# Altium schematic sheet FBridge.SchDoc
size A4; SheetNumber: 4; SheetTotal: 6
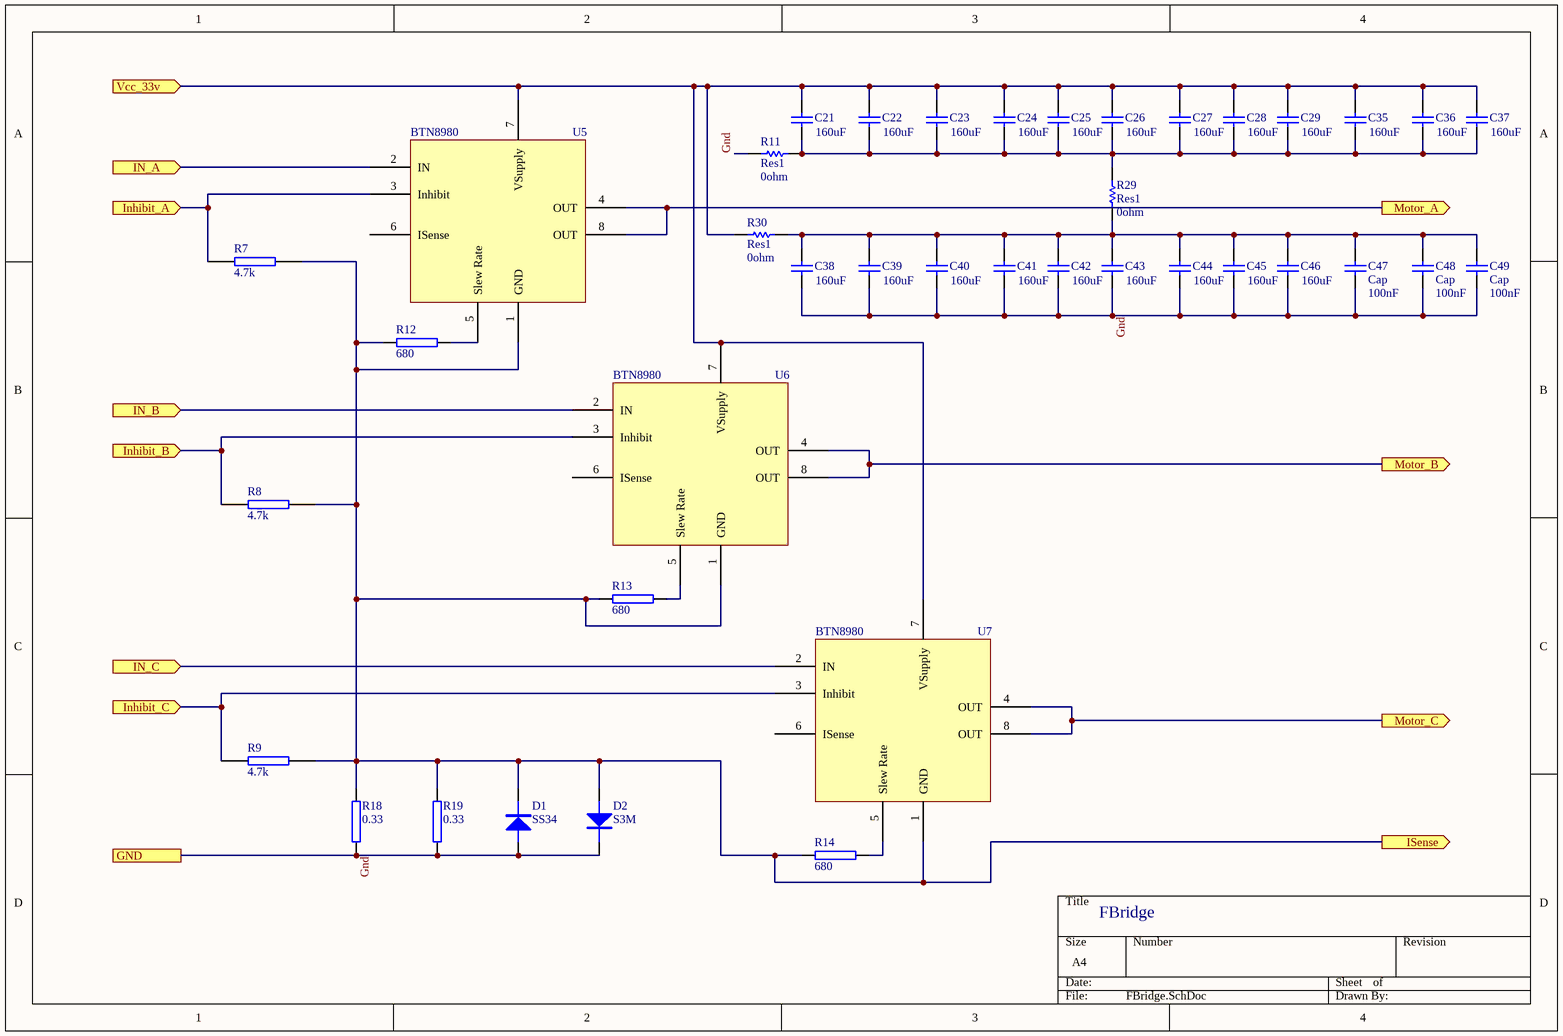
[diagram p0: FBridge.SchDoc]

## Parts
C21  value 160uF  [Tantalum_9545]  (hidden comment: Cap)
C22  value 160uF  [Tantalum_9545]  (hidden comment: Cap)
C23  value 160uF  [Tantalum_9545]  (hidden comment: Cap)
C24  value 160uF  [Tantalum_9545]  (hidden comment: Cap)
C25  value 160uF  [Tantalum_9545]  (hidden comment: Cap)
C26  value 160uF  [Tantalum_9545]  (hidden comment: Cap)
C27  value 160uF  [Tantalum_9545]  (hidden comment: Cap)
C28  value 160uF  [Tantalum_9545]  (hidden comment: Cap)
C29  value 160uF  [Tantalum_9545]  (hidden comment: Cap)
C35  value 160uF  [Tantalum_9545]  (hidden comment: Cap)
C36  value 160uF  [Tantalum_9545]  (hidden comment: Cap)
C37  value 160uF  [Tantalum_9545]  (hidden comment: Cap)
C38  value 160uF  [Tantalum_9545]  (hidden comment: Cap)
C39  value 160uF  [Tantalum_9545]  (hidden comment: Cap)
C40  value 160uF  [Tantalum_9545]  (hidden comment: Cap)
C41  value 160uF  [Tantalum_9545]  (hidden comment: Cap)
C42  value 160uF  [Tantalum_9545]  (hidden comment: Cap)
C43  value 160uF  [Tantalum_9545]  (hidden comment: Cap)
C44  value 160uF  [Tantalum_9545]  (hidden comment: Cap)
C45  value 160uF  [Tantalum_9545]  (hidden comment: Cap)
C46  value 160uF  [Tantalum_9545]  (hidden comment: Cap)
C47  Cap  value 100nF  [1206_SMD]
C48  Cap  value 100nF  [1206_SMD]
C49  Cap  value 100nF  [1206_SMD]
D1  SS34  [SMA]
D2  S3M  [SMC]
R7  4.7k  [1206_SMD]
R8  4.7k  [1206_SMD]
R9  4.7k  [1206_SMD]
R11  Res1  value 0ohm  [2010_smd]
R12  680  [1206_SMD]
R13  680  [1206_SMD]
R14  680  [1206_SMD]
R18  0.33  [2010_smd]
R19  0.33  [2010_smd]
R29  Res1  value 0ohm  [2010_smd]
R30  Res1  value 0ohm  [2010_smd]
U5  BTN8980  [TO263_7]
U6  BTN8980  [TO263_7]
U7  BTN8980  [TO263_7]

## Ports
GND, IN_A (in), IN_B (in), IN_C (in), Inhibit_A (in), Inhibit_B (in), Inhibit_C (in), ISense (out), Motor_A (out), Motor_B (out), Motor_C (out), Vcc_33v (in)

## Nets
Gnd: C38.2 C39.2 C40.2 C41.2 C42.2 C43.2 C44.2 C45.2 C46.2 C47.1 C48.1 C49.1 D1.A D2.K R11.1 R18.1 R19.1 ; port GND
IN_A: U5.2(IN) ; port IN_A
IN_B: U6.2(IN) ; port IN_B
IN_C: U7.2(IN) ; port IN_C
Inhibit_A: R7.1 U5.3(Inhibit) ; port Inhibit_A
Inhibit_B: R8.1 U6.3(Inhibit) ; port Inhibit_B
Inhibit_C: R9.1 U7.3(Inhibit) ; port Inhibit_C
ISense: D1.K D2.A R7.2 R8.2 R9.2 R12.2 R13.2 R14.2 R18.2 R19.2 U5.1(GND) U6.1(GND) U7.1(GND) ; port ISense
Motor_A: U5.4(OUT) U5.8(OUT) ; port Motor_A
Motor_B: U6.4(OUT) U6.8(OUT) ; port Motor_B
Motor_C: U7.4(OUT) U7.8(OUT) ; port Motor_C
Vcc_33v: C21.1 C22.1 C23.1 C24.1 C25.1 C26.1 C27.1 C28.1 C29.1 C35.1 C36.1 C37.1 R30.1 U5.7(VSupply) U6.7(VSupply) U7.7(VSupply) ; port Vcc_33v
NetC21_2: C21.2 C22.2 C23.2 C24.2 C25.2 C26.2 C27.2 C28.2 C29.2 C35.2 C36.2 C37.2 R11.2 R29.2
NetC38_1: C38.1 C39.1 C40.1 C41.1 C42.1 C43.1 C44.1 C45.1 C46.1 C47.2 C48.2 C49.2 R29.1 R30.2
NetR12_1: R12.1 U5.5(Slew_Rate)
NetR13_1: R13.1 U6.5(Slew_Rate)
NetR14_1: R14.1 U7.5(Slew_Rate)

Not connected (* = marked no-connect by the designer): U5 6(ISense); U6 6(ISense); U7 6(ISense)

## Notes on the sheet
- FBridge

## Library data of the parts
C21-C29 C35-C49 = Cap: Capacitor; Published: 8-Jun-2000; LatestRevisionDate: 17-Jul-2002; LatestRevisionNote: Re-released for DXP Platform.; PackageReference: RAD-0.3; Publisher: Altium Limited; PackageDescription: Radial Cap, Thru-Hole; 2 Leads; 0.3 in Pin Spacing
D1 = DIODE
D2 = DIODE: pin to pad: A>1 K>2
R7-R9 R12-R14 R18 R19 = RES2
R11 R29 R30 = Res1: Resistor; Published: 8-Jun-2000; LatestRevisionDate: 17-Jul-2002; LatestRevisionNote: Re-released for DXP Platform.; PackageReference: AXIAL-0.3; Publisher: Altium Limited; PackageDescription: Axial Device, Thru-Hole; 2 Leads; 0.3 in Pin Spacing